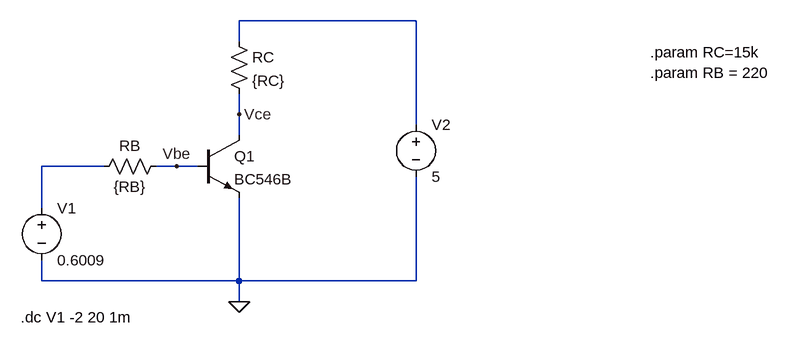
[diagram p0: schematic Circuito_BJT_Curva_Entrada.asc]
Circuito_BJT_Curva_Entrada.asc, the LTspice schematic file:
Version 4
SHEET 1 1196 680
WIRE 496 -64 224 -64
WIRE 224 -32 224 -64
WIRE 224 80 224 48
WIRE 496 96 496 -64
WIRE 224 112 224 80
WIRE 16 160 -80 160
WIRE 128 160 96 160
WIRE 160 160 128 160
WIRE -80 224 -80 160
WIRE -80 336 -80 304
WIRE 224 336 224 208
WIRE 224 336 -80 336
WIRE 496 336 496 176
WIRE 496 336 224 336
WIRE 224 368 224 336
FLAG 224 368 0
FLAG 224 80 Vce
FLAG 128 160 Vbe
SYMBOL npn 160 112 R0
SYMATTR InstName Q1
SYMATTR Value BC546B
SYMBOL voltage -80 208 R0
WINDOW 123 24 124 Left 2
WINDOW 39 0 0 Left 0
SYMATTR InstName V1
SYMATTR Value 0.6009
SYMBOL voltage 496 80 R0
WINDOW 123 0 0 Left 0
WINDOW 39 0 0 Left 0
SYMATTR InstName V2
SYMATTR Value 5
SYMBOL res 208 -48 R0
SYMATTR InstName RC
SYMATTR Value {RC}
SYMBOL res 112 144 R90
WINDOW 0 0 56 VBottom 2
WINDOW 3 32 56 VTop 2
SYMATTR InstName RB
SYMATTR Value {RB}
TEXT 856 -16 Left 2 !.param RC=15k
TEXT 856 16 Left 2 !.param RB = 220
TEXT -112 392 Left 2 !.dc V1 -2 20 1m

The netlist it stands for:
* Circuito_BJT_Curva_Entrada.asc
Q1 Vce Vbe 0 0 BC546B
V1 N002 0 0.6009
V2 N001 0 5
RC N001 Vce {RC}
RB Vbe N002 {RB}
.model NPN NPN
.model PNP PNP
.lib standard.bjt
.param RC=15k
.param RB = 220
.dc V1 -2 20 1m
.backanno
.end